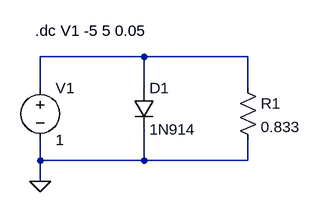
[diagram p0: schematic diode_2.asc]
diode_2.asc, the LTspice schematic file:
Version 4
SHEET 1 880 680
WIRE 112 32 -48 32
WIRE 272 32 112 32
WIRE -48 80 -48 32
WIRE 112 80 112 32
WIRE 272 80 272 32
WIRE -48 192 -48 160
WIRE 112 192 112 144
WIRE 112 192 -48 192
WIRE 272 192 272 160
WIRE 272 192 112 192
WIRE -48 224 -48 192
FLAG -48 224 0
SYMBOL diode 96 80 R0
SYMATTR InstName D1
SYMATTR Value 1N914
SYMBOL voltage -48 64 R0
WINDOW 123 0 0 Left 0
WINDOW 39 0 0 Left 0
SYMATTR InstName V1
SYMATTR Value 1
SYMBOL res 256 64 R0
SYMATTR InstName R1
SYMATTR Value 0.833
TEXT -56 -8 Left 2 !.dc V1 -5 5 0.05

The netlist it stands for:
* diode_2.asc
D1 N001 0 1N914
V1 N001 0 1
R1 N001 0 0.833
.model D D
.lib standard.dio
.dc V1 -5 5 0.05
.backanno
.end